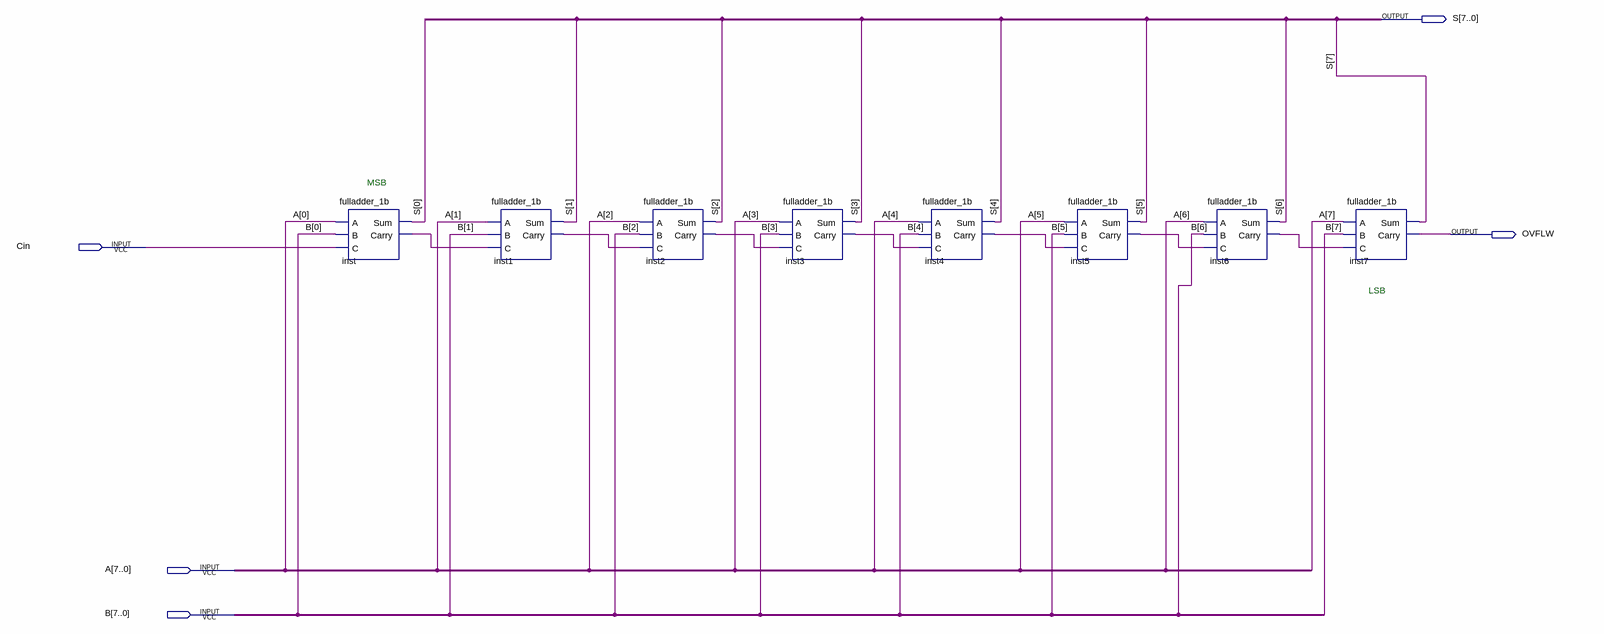
[diagram p0: schematic sheet]
// Quartus schematic RCA_8b_2w.bdf as structural Verilog: 8 symbols, 5 pins
module RCA_8b_2w (
  input  Cin,
  input  [7:0] A,
  input  [7:0] B,
  output [7:0] S,
  output OVFLW
);

  wire inst1_carry, inst2_carry, inst3_carry, inst4_carry, inst5_carry, inst6_carry, inst_carry;

  fulladder_1b inst (.A(A[0]), .B(B[0]), .C(Cin), .Sum(S[0]), .Carry(inst_carry));
  fulladder_1b inst1 (.A(A[1]), .B(B[1]), .C(inst_carry), .Sum(S[1]), .Carry(inst1_carry));
  fulladder_1b inst2 (.A(A[2]), .B(B[2]), .C(inst1_carry), .Sum(S[2]), .Carry(inst2_carry));
  fulladder_1b inst3 (.A(A[3]), .B(B[3]), .C(inst2_carry), .Sum(S[3]), .Carry(inst3_carry));
  fulladder_1b inst4 (.A(A[4]), .B(B[4]), .C(inst3_carry), .Sum(S[4]), .Carry(inst4_carry));
  fulladder_1b inst5 (.A(A[5]), .B(B[5]), .C(inst4_carry), .Sum(S[5]), .Carry(inst5_carry));
  fulladder_1b inst6 (.A(A[6]), .B(B[6]), .C(inst5_carry), .Sum(S[6]), .Carry(inst6_carry));
  fulladder_1b inst7 (.A(A[7]), .B(B[7]), .C(inst6_carry), .Sum(S[7]), .Carry(OVFLW));

  // Notes on the sheet:
  //   MSB
  //   LSB
endmodule
